# EAGLE design musicbusinesscard (EAGLE 9.4.2)
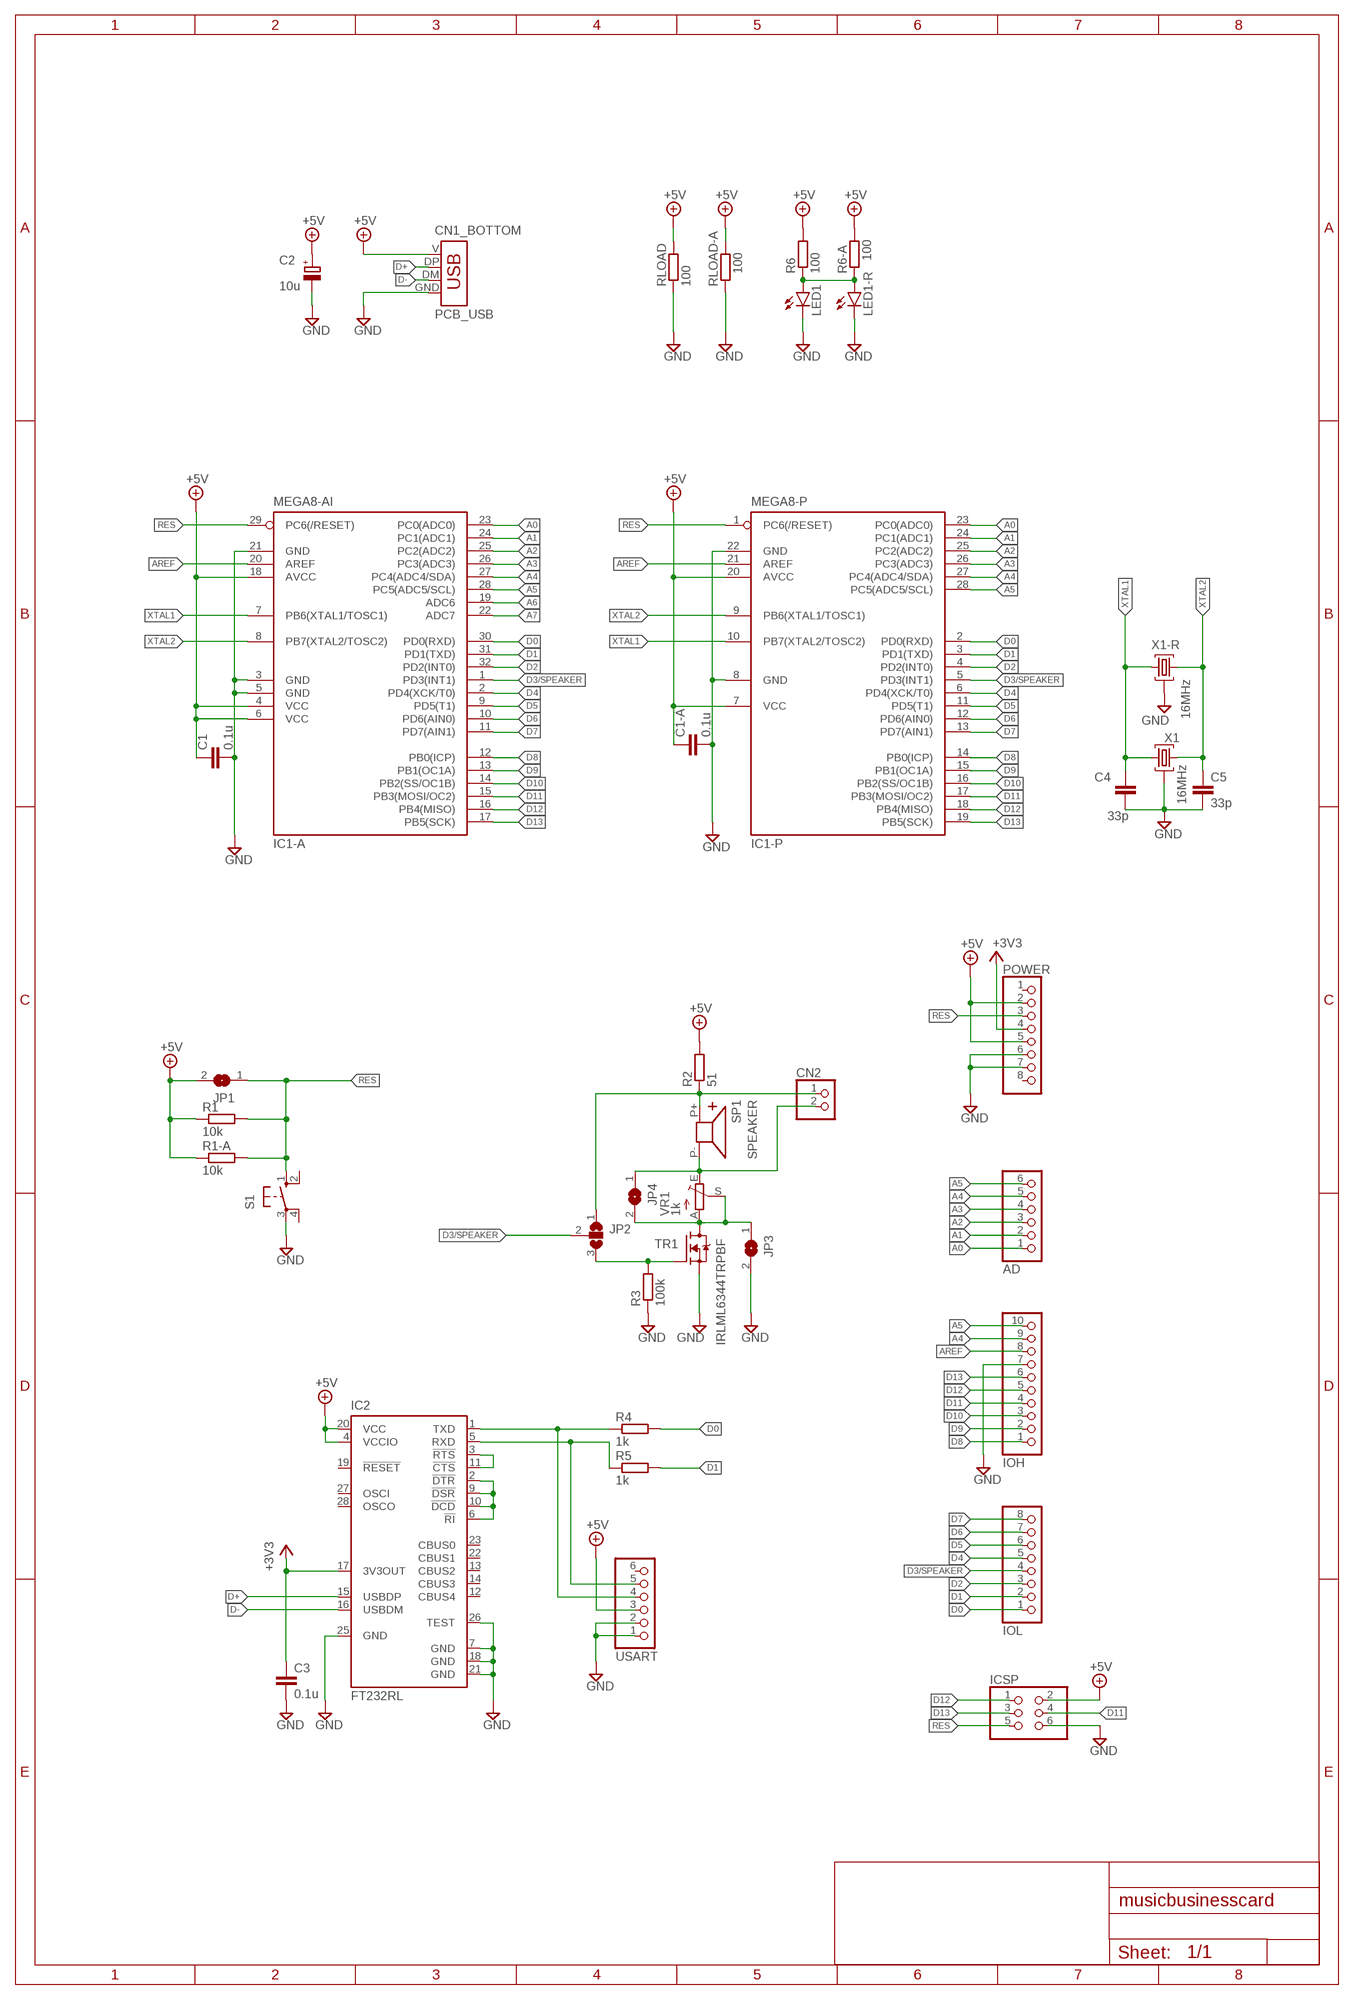
[diagram p0: schematic, sheet 1]

## Parts
AD  PINHD-1X6  [1X06]
C1  0.1u  C-EUC3216  [C3216]
C1-A  0.1u  C-EU050-024X044  [C050-024X044]
C2  10u  CPOL-EUTT2D5  [TT2D5]
C3  0.1u  C-EUC3216  [C3216]
C4  33p  C-EU050-024X044  [C050-024X044]
C5  33p  C-EU050-024X044  [C050-024X044]
CN1_BOTTOM  PCB_USB  [PCB_USB]
CN2  PINHD-1X2  [1X02]
IC1-A  MEGA8-AI  [TQFP32-08]
IC1-P  MEGA8-P  [DIL28-3]
IC2  FT232RL  [SSOP28]
ICSP  PINHD-2X3  [2X03]
IOH  PINHD-1X10  [1X10]
IOL  PINHD-1X8  [1X08]
JP1  SJ  [SJ]
JP2  SJ2W  [SJ_2]
JP3  SJ  [SJ]
JP4  SJ  [SJ]
LED1  LEDCHIPLED_1206  [CHIPLED_1206]
LED1-R  LED3MM  [LED3MM]
POWER  PINHD-1X8  [1X08]
R1  10k  R-EU_R3216  [R3216]
R1-A  10k  R-EU_0207/10  [0207/10]
R2  51  R-EU_R3216  [R3216]
R3  100k  R-EU_R3216  [R3216]
R4  1k  R-EU_R3216  [R3216]
R5  1k  R-EU_R3216  [R3216]
R6  100  R-EU_R3216  [R3216]
R6-A  100  R-EU_0207/10  [0207/10]
RLOAD  100  R-EU_R3216  [R3216]
RLOAD-A  100  R-EU_0207/10  [0207/10]
S1  10-XX  [B3F-10XX]
SP1  SPEAKER  [SPEAKER]
TR1  IRLML6344TRPBF  [SOT23]
USART  PINHD-1X6  [1X06]
VR1  1k  TRIM_EU-B25P  [B25P]
X1  16MHz  XTAL_MURATA  [XTAL_MURATA]
X1-R  16MHz  14M20BHC49T  [HC49U]

## Nets
+3V3: C3.1 IC2.17(3V3OUT) POWER.4
+5V [power]: C1-A.1 C1.1 C2.+ CN1_BOTTOM.V IC1-A.4(VCC) IC1-A.6(VCC) IC1-A.18(AVCC) IC1-P.7(VCC) IC1-P.20(AVCC) IC2.4(VCCIO) IC2.20(VCC) ICSP.2 JP1.2 POWER.2 POWER.5 R1-A.1 R1.1 R2.2 R6-A.2 R6.2 RLOAD-A.2 RLOAD.2 USART.3
A0: AD.1 IC1-A.23(PC0(ADC0)) IC1-P.23(PC0(ADC0))
A1: AD.2 IC1-A.24(PC1(ADC1)) IC1-P.24(PC1(ADC1))
A2: AD.3 IC1-A.25(PC2(ADC2)) IC1-P.25(PC2(ADC2))
A3: AD.4 IC1-A.26(PC3(ADC3)) IC1-P.26(PC3(ADC3))
A4: AD.5 IC1-A.27(PC4(ADC4/SDA)) IC1-P.27(PC4(ADC4/SDA)) IOH.9
A5: AD.6 IC1-A.28(PC5(ADC5/SCL)) IC1-P.28(PC5(ADC5/SCL)) IOH.10
A6: IC1-A.19(ADC6)
A7: IC1-A.22(ADC7)
AREF: IC1-A.20(AREF) IC1-P.21(AREF) IOH.8
D0: IC1-A.30(PD0(RXD)) IC1-P.2(PD0(RXD)) IOL.1 R4.2
D1: IC1-A.31(PD1(TXD)) IC1-P.3(PD1(TXD)) IOL.2 R5.2
D2: IC1-A.32(PD2(INT0)) IC1-P.4(PD2(INT0)) IOL.3
D3/SPEAKER: IC1-A.1(PD3(INT1)) IC1-P.5(PD3(INT1)) IOL.4 JP2.2
D4: IC1-A.2(PD4(XCK/T0)) IC1-P.6(PD4(XCK/T0)) IOL.5
D5: IC1-A.9(PD5(T1)) IC1-P.11(PD5(T1)) IOL.6
D6: IC1-A.10(PD6(AIN0)) IC1-P.12(PD6(AIN0)) IOL.7
D7: IC1-A.11(PD7(AIN1)) IC1-P.13(PD7(AIN1)) IOL.8
D8: IC1-A.12(PB0(ICP)) IC1-P.14(PB0(ICP)) IOH.1
D9: IC1-A.13(PB1(OC1A)) IC1-P.15(PB1(OC1A)) IOH.2
D10: IC1-A.14(PB2(SS/OC1B)) IC1-P.16(PB2(SS/OC1B)) IOH.3
D11: IC1-A.15(PB3(MOSI/OC2)) IC1-P.17(PB3(MOSI/OC2)) ICSP.4 IOH.4
D12: IC1-A.16(PB4(MISO)) IC1-P.18(PB4(MISO)) ICSP.1 IOH.5
D13: IC1-A.17(PB5(SCK)) IC1-P.19(PB5(SCK)) ICSP.3 IOH.6
D+: CN1_BOTTOM.DP IC2.15(USBDP)
D-: CN1_BOTTOM.DM IC2.16(USBDM)
GND: C1-A.2 C1.2 C2.- C3.2 C4.2 C5.2 CN1_BOTTOM.GND IC1-A.3(GND) IC1-A.5(GND) IC1-A.21(GND) IC1-P.8(GND) IC1-P.22(GND) IC2.7(GND) IC2.18(GND) IC2.21(GND) IC2.25(GND) IC2.26(TEST) ICSP.6 IOH.7 JP3.2 LED1-R.K(C) LED1.C POWER.6 POWER.7 R3.1 RLOAD-A.1 RLOAD.1 S1.3(P) TR1.2(S) USART.1 USART.2 X1-R.2 X1.2
N$1: JP2.3 R3.2 TR1.1(G)
N$2: CN2.2 JP4.1 SP1.P- VR1.E
N$3: CN2.1 JP2.1 R2.1 SP1.P+
N$4: JP3.1 JP4.2 TR1.3(D) VR1.A VR1.S
N$5: IC2.2(!DTR) IC2.6(!RI) IC2.9(!DSR) IC2.10(!DCD)
N$6: IC2.3(!RTS) IC2.11(!CTS)
N$7: IC2.1(TXD) R4.1 USART.4
N$8: IC2.5(RXD) R5.1 USART.5
N$9: LED1-R.A LED1.A R6-A.1 R6.1
RES: IC1-A.29(PC6(/RESET)) IC1-P.1(PC6(/RESET)) ICSP.5 JP1.1 POWER.3 R1-A.2 R1.2 S1.1(S)
XTAL1: C4.1 IC1-A.7(PB6(XTAL1/TOSC1)) IC1-P.10(PB7(XTAL2/TOSC2)) X1-R.1 X1.1
XTAL2: C5.1 IC1-A.8(PB7(XTAL2/TOSC2)) IC1-P.9(PB6(XTAL1/TOSC1)) X1-R.3 X1.3
Unconnected: IC2.12(CBUS4) IC2.13(CBUS2) IC2.14(CBUS3) IC2.19(!RESET) IC2.22(CBUS1) IC2.23(CBUS0) IC2.27(OSCI) IC2.28(OSCO) POWER.1 POWER.8 S1.2(S1) S1.4(P1) USART.6

## Library data of the parts
AD USART = pinhead-k:PINHD-1X6: PIN HEADER
C1 C1-A C3-C5 = rcl:C-EU: CAPACITOR, European symbol; SPICEPREFIX: C
C2 = rcl:CPOL-EU: POLARIZED CAPACITOR, European symbol; SPICEPREFIX: C
CN1_BOTTOM = pcb_usb:PCB_USB
CN2 = pinhead-k:PINHD-1X2: PIN HEADER
IC1-A = atmel:MEGA8: MICROCONTROLLER 8 Kbytes FLASH, 1 kbytes SRAM, 512 bytes EEPROM, USART, 6-channel 10 bit ADC, 2-channel 8 bit ADC Pin compatible with Atmega48, ATMega88, ATMega168 Source: avr.lbr; MPN: ATMEGA8-16AU; OC_FARNELL: 9171371; OC_NEWARK: 73M8863
IC1-P = atmel:MEGA8-P: MICROCONTROLLER 8 Kbytes FLASH, 1 kbytes SRAM, 512 bytes EEPROM, USART, 4-channel 10 bit ADC, 2-channel 8 bit ADC Pin compatible with Atmega48, ATMega88, ATMega168 Source: avr.lbr; OC_FARNELL: unknown; OC_NEWARK: unknown
IC2 = ftdichip:FT232R: Source: http://www.ftdichip.com/Documents/DataSheets/DS_FT232R_v104.pdf; MPN: FT232RL; OC_FARNELL: 1146032; OC_NEWARK: 91K9918
ICSP = pinhead:PINHD-2X3: PIN HEADER
IOH = pinhead-k:PINHD-1X10: PIN HEADER
IOL POWER = pinhead-k:PINHD-1X8: PIN HEADER
JP1 JP3 JP4 = jumper:SJ: SMD solder JUMPER
JP2 = jumper:SJ2W: SMD solder JUMPER
LED1 LED1-R = led:LED: LED OSRAM: - CHIPLED LG R971, LG N971, LY N971, LG Q971, LY Q971, LO R971, LY R971 LH N974, LH R974 LS Q976, LO Q976, LY Q976 LO Q996 - Hyper CHIPLED LW Q18S LB Q993, LB Q99A, LB R99A - SideLED LS A670, LO A670, LY A670, LG A670, LP A670 LB A673, LV A673, LT A673, LW A673 LH A674 LY A675 LS A676, LA A676, LO A676, LY A676, LW A676 LS A679, LY A679, LG A679 - Hyper Micro SIDELED® LS Y876, LA Y876, LO Y876, LY Y876 LT Y87S - SmartLED LW L88C, LW L88S LB L89C, LB L89S, LG L890 LS L89K, LO L89K, LY L89K LS L896, LA L896, LO L896, LY L896 - TOPLED LS T670, LO T670, LY T670, LG T670, LP T670 LSG T670, LSP T670, LSY T670, LOP T670, LYG T670 LG T671, LOG T671, LSG T671 LB T673, LV T673, LT T673, LW T673 LH T674 LS T676, LA T676, LO T676, LY T676, LB T676, LH T676, LSB T676, LW T676 LB T67C, LV T67C, LT T67C, LS T67K, LO T67K, LY T67K, LW E67C LS E67B, LA E67B, LO E67B, LY E67B, LB E67C, LV E67C, LT E67C LW T67C LS T679, LY T679, LG T679 LS T770, LO T770, LY T770, LG T770, LP T770 LB T773, LV T773, LT T773, LW T773 LH T774 LS E675, LA E675, LY E675, LS T675 LS T776, LA T776, LO T776, LY T776, LB T776 LHGB T686 LT T68C, LB T68C - Hyper Mini TOPLED® LB M676 - Mini TOPLED Santana® LG M470 LS M47K, LO M47K, LY M47K Source: http://www.osram.convergy.de LUXEON: - LUMILED® LXK2-PW12-R00, LXK2-PW12-S00, LXK2-PW14-U00, LXK2-PW14-V00 LXK2-PM12-R00, LXK2-PM12-S00, LXK2-PM14-U00 LXK2-PE12-Q00, LXK2-PE12-R00, LXK2-PE12-S00, LXK2-PE14-T00, LXK2-PE14-U00 LXK2-PB12-K00, LXK2-PB12-L00, LXK2-PB12-M00, LXK2-PB14-N00, LXK2-PB14-P00, LXK2-PB14-Q00 LXK2-PR12-L00, LXK2-PR12-M00, LXK2-PR14-Q00, LXK2-PR14-R00 LXK2-PD12-Q00, LXK2-PD12-R00, LXK2-PD12-S00 LXK2-PH12-R00, LXK2-PH12-S00 LXK2-PL12-P00, LXK2-PL12-Q00, LXK2-PL12-R00 Source: www.luxeon.com KINGBRIGHT: KA-3528ASYC Source: www.kingbright.com
R1 R1-A R2-R6 R6-A RLOAD RLOAD-A = rcl:R-EU_: RESISTOR, European symbol; SPICEPREFIX: R
S1 = switch-omron:10-XX: OMRON SWITCH; MPN: B3F-1000; OC_FARNELL: 176432; OC_NEWARK: 36M3542
SP1 = CAD_001:SPEAKER
TR1 = CAD_001:IRLML6344TRPBF
VR1 = pot:TRIM_EU-: POTENTIOMETER
X1 = murata-ceralok:XTAL_MURATA
X1-R = crystal:14M20BHC49T: Monolithic Crystal Filters Source: www.vanlong.com; OC_FARNELL: unknown; OC_NEWARK: unknown

## Net classes
0 default: width 0.2 mm, drill 0.4 mm, clearance 0.203 mm
1 power: width 0.4 mm, drill 0.4 mm, clearance 0.203 mm

## Board
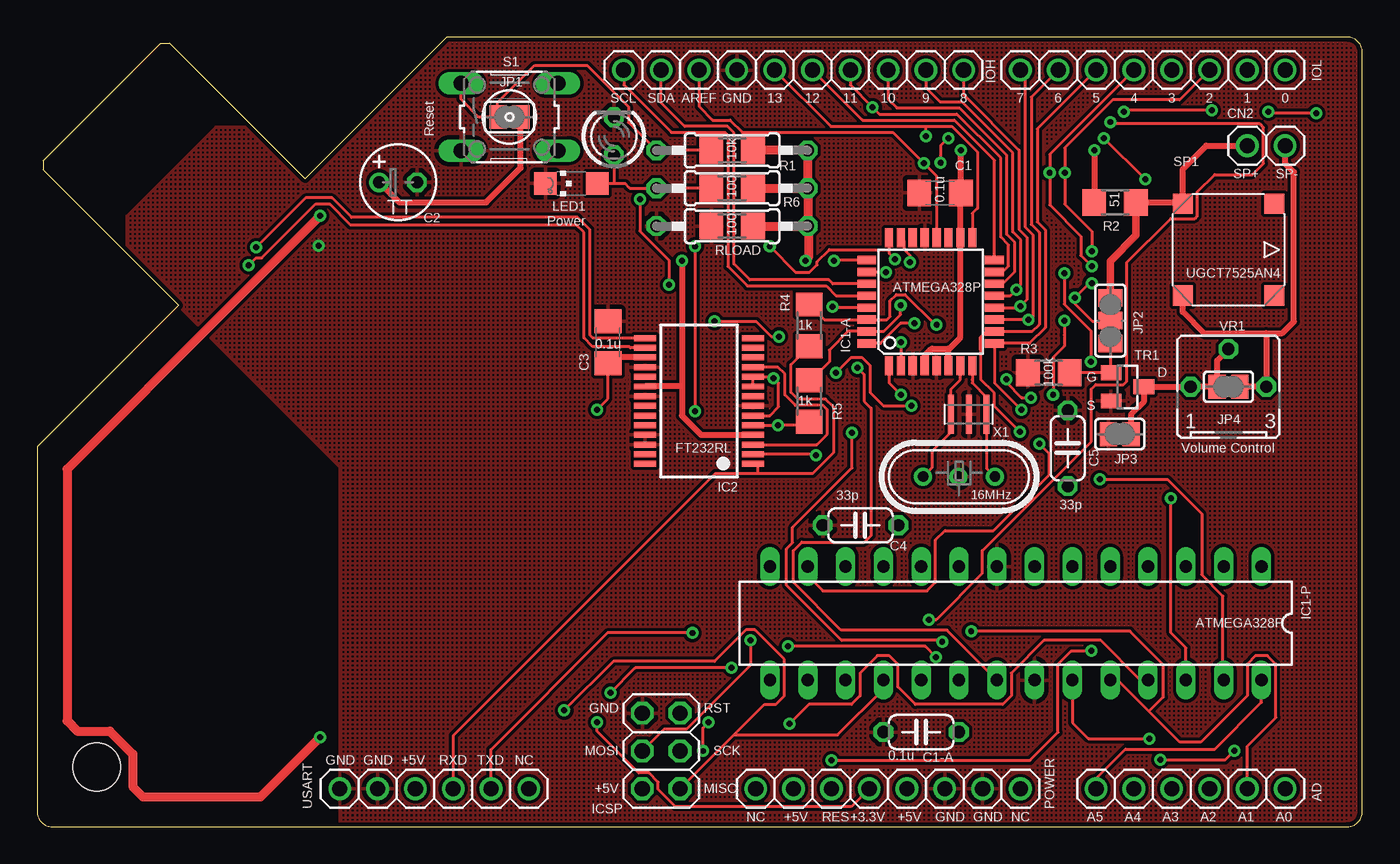
[diagram p1: board, top side]
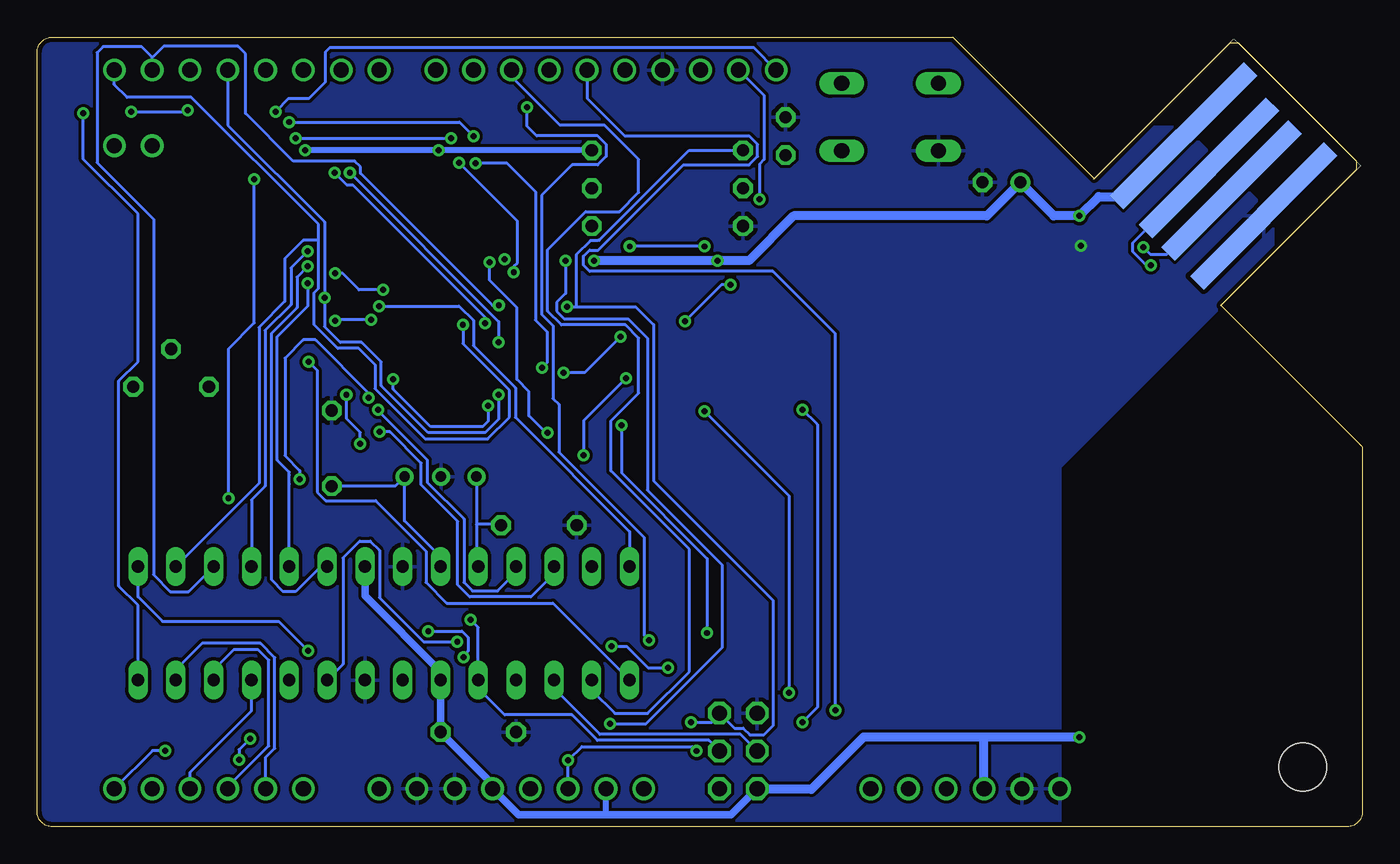
[diagram p2: board, bottom side, seen from below]

Size 89 x 53 mm. Coordinates in mm from the lower left corner, seen from the top.
Outline: 1,0 88,0 arc90 89,1 89,52 arc90 88,53 27.5,53 18,43.5 8.9,52.6 8.3,52.6 0.4,44.7 0.4,44.1 9.5,35 0,25.5 0,1 arc90 1,0
Copper layers (1*16): Top 0.035mm / dielectric 1.5mm / Bottom 0.035mm
Design rules "wsc *": minimum track width 6mil, minimum drill 0.35mm, track to track 0.21mm, track to pad 0.21mm, pad to pad 0.21mm, via to via 0.21mm, smd to smd 0.21mm, copper to edge 0.3mm, drill to drill 6mil, minimum pad ring 10mil, minimum via ring 8mil, stop-mask expansion 4mil, vias tented up to drill 0mil, thermal gap 0.3mm
Holes 3.2 mm at 4,4

### Footprints (pad centres in the part's own frame; a part is rotated, then mirrored left to right if it is on the bottom)
1X06 = drill 1.016: 1 -6.35,0; 2 -3.81,0; 3 -1.27,0; 4 1.27,0; 5 3.81,0; 6 6.35,0
C3216 = smd 1.6 x 1.8: 1 -1.4,0; 2 1.4,0
C050-024X044 = drill 0.813 octagon: 1 -2.54,0; 2 2.54,0
TT2D5 = drill 0.813: + -1.27,0 | drill 0.813 octagon: - 1.27,0
PCB_USB = smd 1.27 x 12.065 rotated 45: DM -0.732,-0.796; DP 0.794,0.731 | smd 1.27 x 12.7 rotated 45: GND 2.501,2.886; V -2.888,-2.502
1X02 = drill 1.016: 1 -1.27,0; 2 1.27,0
TQFP32-08 = smd 1.27 x 0.559: 1 -4.293,2.8; 2 -4.293,2; 3 -4.293,1.2; 4 -4.293,0.4; 5 -4.293,-0.4; 6 -4.293,-1.2; 7 -4.293,-2; 8 -4.293,-2.8; 17 4.293,-2.8; 18 4.293,-2; 19 4.293,-1.2; 20 4.293,-0.4; 21 4.293,0.4; 22 4.293,1.2; 23 4.293,2; 24 4.293,2.8 | smd 0.559 x 1.27: 9 -2.8,-4.293; 10 -2,-4.293; 11 -1.2,-4.293; 12 -0.4,-4.293; 13 0.4,-4.293; 14 1.2,-4.293; 15 2,-4.293; 16 2.8,-4.293; 25 2.8,4.293; 26 2,4.293; 27 1.2,4.293; 28 0.4,4.293; 29 -0.4,4.293; 30 -1.2,4.293; 31 -2,4.293; 32 -2.8,4.293
DIL28-3 = drill 0.813 long: 1 -16.51,-3.81; 2 -13.97,-3.81; 3 -11.43,-3.81; 4 -8.89,-3.81; 5 -6.35,-3.81; 6 -3.81,-3.81; 7 -1.27,-3.81; 8 1.27,-3.81; 9 3.81,-3.81; 10 6.35,-3.81; 11 8.89,-3.81; 12 11.43,-3.81; 13 13.97,-3.81; 14 16.51,-3.81; 15 16.51,3.81; 16 13.97,3.81; 17 11.43,3.81; 18 8.89,3.81; 19 6.35,3.81; 20 3.81,3.81; 21 1.27,3.81; 22 -1.27,3.81; 23 -3.81,3.81; 24 -6.35,3.81; 25 -8.89,3.81; 26 -11.43,3.81; 27 -13.97,3.81; 28 -16.51,3.81
SSOP28 = smd 0.4 x 1.5: 1 -4.225,-3.625; 2 -3.575,-3.625; 3 -2.925,-3.625; 4 -2.275,-3.625; 5 -1.625,-3.625; 6 -0.975,-3.625; 7 -0.325,-3.625; 8 0.325,-3.625; 9 0.975,-3.625; 10 1.625,-3.625; 11 2.275,-3.625; 12 2.925,-3.625; 13 3.575,-3.625; 14 4.225,-3.625; 15 4.225,3.625; 16 3.575,3.625; 17 2.925,3.625; 18 2.275,3.625; 19 1.625,3.625; 20 0.975,3.625; 21 0.325,3.625; 22 -0.325,3.625; 23 -0.975,3.625; 24 -1.625,3.625; 25 -2.275,3.625; 26 -2.925,3.625; 27 -3.575,3.625; 28 -4.225,3.625
2X03 = drill 1.016 octagon: 1 -2.54,-1.27; 2 -2.54,1.27; 3 0,-1.27; 4 0,1.27; 5 2.54,-1.27; 6 2.54,1.27
1X10 = drill 1.016: 1 -11.43,0; 2 -8.89,0; 3 -6.35,0; 4 -3.81,0; 5 -1.27,0; 6 1.27,0; 7 3.81,0; 8 6.35,0; 9 8.89,0; 10 11.43,0
1X08 = drill 1.016: 1 -8.89,0; 2 -6.35,0; 3 -3.81,0; 4 -1.27,0; 5 1.27,0; 6 3.81,0; 7 6.35,0; 8 8.89,0
SJ = smd 1.168 x 1.6: 1 -0.762,0; 2 0.762,0
SJ_2 = smd 1.168 x 1.6: 1 -1.524,0; 2 0,0; 3 1.524,0
CHIPLED_1206 = smd 1.5 x 1.5: A 0,-1.75; C 0,1.75
LED3MM = drill 0.813 octagon: A -1.27,0; K 1.27,0
R3216 = smd 1.6 x 1.8: 1 -1.4,0; 2 1.4,0
0207/10 = drill 0.813 octagon: 1 -5.08,0; 2 5.08,0
B3F-10XX = drill 1.016 long: 1 -3.251,2.261; 2 3.251,2.261; 3 -3.251,-2.261; 4 3.251,-2.261
SPEAKER = smd 1.35 x 1.35: D1 3.075,3.075; D2 3.075,-3.075; P+ -3.075,3.075; P- -3.075,-3.075
SOT23 = smd 1 x 1.4: 1 -0.95,-1.1; 2 0.95,-1.1; 3 0,1.1
B25P = drill 0.813 octagon: A -2.54,0; E 2.54,0; S 0,2.54
XTAL_MURATA = smd 0.4 x 2.6: 1 1.183,-0.066; 2 -0.017,-0.066; 3 -1.217,-0.066
HC49U = drill 0.7 pad 1.2: 1 -2.413,0; 2 -0.027,0; 3 2.413,0

### Placement (x,y rotation side)
AD  77.47,2.54 180 top
C1  60.64,42.55 180 top
C1-A  59.37,6.35 180 top
C2  24.24,43.25 0 top
C3  38.34,32.52 90 top
C4  55.3,20.23 180 top
C5  69.22,25.4 90 top
CN1_BOTTOM  9.5,43.5 270 bottom
CN2  82.55,45.72 0 top
IC1-A  60.01,35.24 90 top
IC1-P  65.72,13.65 180 top
IC2  44.45,28.57 90 top
ICSP  41.91,5.08 90 top
IOH  50.8,50.8 180 top
IOL  74.93,50.8 180 top
JP1  31.71,47.64 0 top
JP2  72.07,33.97 270 top
JP3  72.71,26.35 180 top
JP4  80.01,29.53 180 top
LED1  35.88,43.18 90 top
LED1-R  38.73,46.35 90 top
POWER  57.15,2.54 0 top
R1  46.67,45.4 180 top
R1-A  46.67,45.4 180 top
R2  72.39,41.91 180 top
R3  67.94,30.48 0 top
R4  51.85,33.66 90 top
R5  51.85,28.57 90 top
R6  46.67,42.86 0 top
R6-A  46.67,42.86 0 top
RLOAD  46.67,40.32 0 top
RLOAD-A  46.67,40.32 0 top
S1  31.71,47.64 0 top
SP1  80.01,38.73 0 top
TR1  73.22,29.53 270 top
USART  26.67,2.54 0 top
VR1  80.01,29.53 0 top
X1  62.55,27.62 180 top
X1-R  61.91,23.5 0 top

### Tracks (layer width: path | path; a pad name or v marks a point on that pad's centre or on a via)
+3V3  (via drill 0.4)
  Top 0.2: C3.1 38.34,28.73 v37.6,28 | v37.6,7 37.6,6.41 40.4,3.61 41.08,3.61 41.71,2.98 41.71,2.49 42.86,1.34 54.68,1.34 POWER.4
  Top 0.4: IC2.17 38.72,31.5 C3.1
  Bottom 0.2: v37.6,7 36.6,8 36.6,27 v37.6,28
+5V  (via drill 0.4)
  Top 0.4: v62.04,45.4 C1.1 62.01,42.51 IC1-A.18 62.01,32.83 61.28,32.1 61.2,32.1 | v43.3,38 43.3,29.55 | 43.3,29.55 IC2.20 | 43.3,29.55 43.3,27.6 44.6,26.3 IC2.4 | v71,45.4 R2.2 | IC1-A.4 59.61,31.64 59.96,32 59.99,32 60.1,32.1 61.2,32.1 | IC1-A.6 61.21,32.09 61.2,32.1 | C2.+ 24.31,41.91 30.16,41.91 32.48,44.22 32.48,47.4
  Top 0.5: 32.48,47.4 JP1.2
  Top 0.6: v19,41 12.8,34.8 2,24 2,7.1 2.68,6.42 4.87,6.42 6.42,4.87 6.42,2.68 7.1,2 15,2 v19,6 | v51.6,38 51.8,38.2 51.8,40.27 RLOAD-A.2 | R6-A.2 RLOAD-A.2 | R6-A.2 R1-A.1 R1.1 | R6.2 R6-A.2 | RLOAD.2 RLOAD-A.2
  Bottom 0.4: R1-A.1 v62.04,45.4 v71,45.4 | 50.8,0.79 POWER.2
  Bottom 0.5: ICSP.2 42.39,0.79 50.8,0.79 56.67,0.79 POWER.5 58.42,2.86 C1-A.1 IC1-P.20 61.91,10.41 66.99,15.49 IC1-P.7
  Bottom 0.6: CN1_BOTTOM.V 16.09,42.3 17.7,42.3 v19,41 20.71,41 C2.+ 25.22,41 38.2,41 41.2,38 v43.3,38 v51.6,38 | v19,6 25.5,6 | 25.5,6 33.5,6 37,2.5 40.6,2.5 ICSP.2 | USART.3 25.4,5.9 25.5,6
A0  (via drill 0.4)
  Top 0.2: IC1-P.23 69.53,6.99 70.6,5.91 v74.7,5.91 | IC1-A.23 58.22,39.33 58.22,38.77 58.62,38.37 v58.62,37.9 | v54.73,26.45 54.73,24.09 50.74,20.09 50.74,19.07 50.33,18.66 50.33,16.2 54.02,12.51 60.68,12.51 v60.78,12.4 | v75.44,4.49 79.79,4.49 v80.4,5.1
  Bottom 0.2: v54.73,26.45 54.84,26.45 55.97,27.57 55.97,29.21 56.78,30.03 56.78,34.85 58.62,36.68 v58.62,37.9 | v60.78,12.4 63.04,12.4 66.01,15.38 66.01,18.55 66.62,19.17 67.34,19.17 68.47,18.04 68.47,10.9 IC1-P.23 | v74.7,5.91 75.44,5.17 v75.44,4.49 | v80.4,5.1 81.26,5.1 AD.1
A1  (via drill 0.4)
  Top 0.2: AD.2 81.28,5.4 83.2,7.32 83.2,10.9 82.63,11.47 81.83,11.47 81.26,10.9 81.26,8.78 78.15,5.67 76.75,5.67 74.68,7.75 | IC1-P.24 72.58,9.84 74.68,7.75 | IC1-A.24 57.21,38.74 | 57.21,38.74 57.21,38.49 v57.6,38.1 | 57.21,38.74 53.2,38.74 52.38,37.92 52.38,37.72 51.87,37.21 50.94,37.21 v49.2,38.95 | v46.64,10.66 40.16,10.66 v38.5,9 | v50.43,12.1 59.66,12.1 v60.37,11.38 | v62.73,13.12 73.39,13.12 75.64,10.87 75.64,8.71 74.68,7.75 | v44.18,38.95 v44.18,27.88
  Bottom 0.2: v44.18,38.95 v49.2,38.95 | v46.64,10.66 47.97,10.66 49.41,12.1 v50.43,12.1 | v60.37,11.38 60.37,11.47 60.06,11.78 60.06,12.71 60.48,13.12 v62.73,13.12 | v38.5,9 38.5,22.2 v44.18,27.88
A2  (via drill 0.4)
  Top 0.2: v50.52,6.91 51.82,8.21 54.69,8.21 55.26,8.78 55.26,10.31 56.43,11.47 57.23,11.47 57.8,10.9 57.8,9.38 58.97,8.21 64.85,8.21 65.42,8.78 65.42,10.31 67.63,12.51 71.44,12.51 74.11,9.84 IC1-P.25 | IC1-A.25 53.56,38.04 v53.51,38
  Bottom 0.2: AD.3 78.74,3.64 74.61,7.77 IC1-P.25 | v50.52,6.91 48.1,6.91 43.01,12.01 43.01,17.59 48.01,22.59 48.01,32.79 49.32,34.1 53.6,34.1 54.11,34.6 54.11,35.2 53.51,35.8 v53.51,38
A3  (via drill 0.4)
  Top 0.2: v60.68,44.59 60.68,45.72 v61.19,46.23 | v74.42,43.46 v71.65,46.23 | v76.16,22.04 76.16,13 77.15,12.01 IC1-P.26 | v56.99,37.21 55.75,37.21 IC1-A.26
  Bottom 0.2: v56.99,37.21 56.99,37.62 56.78,37.82 56.78,40.69 v60.68,44.59 | v71.65,46.23 v61.19,46.23 | v74.42,43.46 74.42,33.83 76.16,32.08 v76.16,22.04 | AD.4 76.2,2.68 73.45,5.43 73.45,11.17 74.17,11.89 75.8,11.89 77.15,10.54 IC1-P.26
A4  (via drill 0.4)
  Top 0.2: IC1-A.27 53.44,36.44 53.17,36.71 47.87,36.71 46.79,37.79 46.79,46.6 46.37,47.02 43.48,47.02 41.91,48.59 IOH.9 | v71.36,23.31 75.91,23.31 78.21,21.01 78.21,16.91 79.64,15.48 79.64,9.89 IC1-P.27 | v66.73,28.8 66.11,28.8 65.09,29.83 v65.09,30.03 | v49.81,32.9 49.3,32.9 48.28,33.93 v45.49,33.93 | v42.44,36.39 42.44,38.03 40.49,39.98 v40.49,42.13 | v53.64,30.48 54.68,31.51 55.4,31.51 55.94,30.97 55.94,29.15 56.83,28.26 v58.71,28.26
  Bottom 0.2: IC1-P.27 79.69,10.54 77.93,12.3 74,12.3 73.04,11.34 73.04,5.26 73.66,4.64 AD.5 | v71.36,23.31 71.36,23.91 72.36,24.91 72.36,31.46 71.13,32.69 70.31,32.69 66.73,29.11 v66.73,28.8 | v42.44,36.39 43.03,36.39 v45.49,33.93 | v40.49,42.13 40.49,44.48 40.18,44.79 40.18,49.1 41.82,50.74 41.85,50.74 IOH.9 | v49.81,32.9 52.24,30.48 v53.64,30.48 | v58.71,28.26 58.71,27.22 59.08,26.86 62.58,26.86 65.09,29.37 v65.09,30.03
A5  (via drill 0.4)
  Top 0.2: IOH.10 39.4,50.77 39.4,49.8 42.59,46.61 46.2,46.61 46.38,46.43 46.38,37.62 47.7,36.3 53,36.3 53.66,35.64 IC1-A.28 | AD.6 71.12,3.22 73.1,5.2 79.1,5.2 82.23,8.33 IC1-P.28 | v85.9,47.9 82.8,47.9 v82.7,48 | v78.9,48.1 73.1,48.1 v73,48
  Bottom 0.2: IC1-P.28 82.23,14.85 83.52,16.14 83.52,29.93 82.23,31.22 82.23,41.13 85.9,44.8 v85.9,47.9 | v82.7,48 79,48 v78.9,48.1 | IOH.10 40.89,52.32 69.34,52.32 69.65,52.01 69.65,49.99 70.75,48.9 72.11,48.9 v73,48
AREF  (via drill 0.4)
  Top 0.2: IOH.8 44.45,48.35 45.37,47.43 46.54,47.43 47.36,46.61 57.49,46.61 v59.55,44.55 60.41,43.69 IC1-A.20 | IC1-P.21 61.11,13.19 53.99,13.19 50.78,16.4 50.78,18.52 51.35,19.09 55.56,19.09 56,19.54 56,28.11 55.53,28.57 55.53,30.37 v55.1,30.8
  Bottom 0.2: v59.55,44.55 57.45,44.55 55.53,42.63 55.53,34 54.77,33.23 54.77,31.13 v55.1,30.8
D0  (via drill 0.4)
  Top 0.2: R4.2 52.87,34.04 IC1-A.30 57.08,34.04 57.28,34.24 57.28,35.3 57.7,35.72 58.29,35.72 60.32,33.69 v60.41,33.69
  Bottom 0.2: v60.41,33.69 60.41,32.42 57.29,29.3 57.29,27.49 58.74,26.04 62.94,26.04 66.31,29.4 66.31,31.02 67.4,32.11 68.82,32.11 70.41,33.7 70.41,35.84 70.11,36.14 70.11,39.36 | IOL.1 83.82,49.82 82.97,48.97 78.65,48.97 70.11,40.43 70.11,39.36 | 70.11,39.36 71.14,39.36 72.36,38.13 72.36,35.26 74.11,33.52 74.11,23.05 IC1-P.2
D1  (via drill 0.4)
  Top 0.2: R5.2 51.98,29.98 53.2,31.2 53.2,32 54.44,33.24 IC1-A.31 56.86,33.24 58,34.38 v58,35
  Bottom 0.2: v58,35 58.42,35 67.29,43.87 67.29,44.3 67.68,44.69 71.81,44.69 75,47.88 75,51.88 75.5,52.38 80.52,52.38 81.28,51.62 IOL.2 81.28,51.66 81.99,52.37 84.57,52.37 84.97,51.97 84.97,44.59 81.18,40.8 81.18,16.91 80.05,15.79 78.83,15.79 IC1-P.3
D2  (via drill 0.4)
  Top 0.2: IOL.3 76.74,48.8 72.24,48.8 69.02,45.58 v69.02,43.9 69.02,41.79 70.83,39.98 v70.83,38.64 | v58.9,33.8 58,33.8 56.64,32.44 IC1-A.32
  Bottom 0.2: v58.9,33.8 58.9,34.19 67.81,43.09 68.21,43.09 v69.02,43.9 | v70.83,38.64 71.95,37.52 71.95,35.05 73.7,33.31 73.7,22.86 74.61,21.94 IC1-P.4
D3/SPEAKER  (via drill 0.4)
  Top 0.2: IC1-A.1 57.21,29.79 v58,29 | JP2.2 72,33.9 70.9,33.9 69.7,35.1 v69.7,35.52 70.67,36.49 v70.83,36.49
  Bottom 0.2: IOL.4 76.2,47.1 69.7,40.6 v69.7,35.52 69.7,33.57 68.65,32.52 67.22,32.52 65.9,31.2 65.9,29.6 62.74,26.45 58.91,26.45 58,27.35 v58,29 | v70.83,36.49 70.83,34.95 72.88,32.9 72.88,24.6 72.07,23.8 72.07,23.6 72.07,23.01 IC1-P.5
D4  (via drill 0.4)
  Top 0.2: IOL.5 68,45.14 v68,43.9 68,41.74 70.1,39.65 70.1,38.35 v70.83,37.62 | v58,32.52 IC1-A.2
  Bottom 0.2: v68,43.9 58,33.9 v58,32.52 | v70.83,37.62 71.55,36.9 71.55,34.85 73.29,33.11 73.29,16.61 72.47,15.79 71.65,15.79 69.97,17.46 IC1-P.6
D5  (via drill 0.4)
  Top 0.2: IOL.6 67.17,46.85 67.17,40.61 67.7,40.07 67.7,33.51 66.64,32.44 IC1-A.9 64.3,29.8 v66.1,28
  Bottom 0.2: v66.1,28 66.1,27.93 62.8,24.63 62.8,23.12 60.34,20.66 60.34,16.4 59.77,15.83 58.07,15.83 56.83,17.07 IC1-P.11
D6  (via drill 0.4)
  Top 0.2: IOL.7 66.76,48.98 66.76,40.44 67.3,39.9 67.3,33.7 66.84,33.24 IC1-A.10 64.26,33.2 63.7,33.2 63.35,32.85 63.35,32.03 63.4,31.99 63.4,29.99 64.27,29.12 64.27,28.23 65.65,26.85 v66,26.5
  Bottom 0.2: IC1-P.12 54.29,16.97 55.84,15.42 59.94,15.42 60.75,16.23 60.75,20.49 63.21,22.95 63.21,24.4 65.31,26.5 v66,26.5
D7  (via drill 0.4)
  Top 0.2: IOL.8 66.35,50.8 66.35,40.27 66.89,39.73 66.89,34.04 v66.58,34.04 IC1-A.11 | IC1-P.13 51.75,16.85 52.77,15.83 59.77,15.83 60.34,16.4 60.34,19.24 60.98,19.88 64.24,19.88 67.98,23.62 67.98,25.02 v67.3,25.7 | v68.23,29 68.23,31.51 68.98,32.26 68.98,33.02 68.99,33.02 v68.99,33.97
  Bottom 0.2: v67.3,25.7 67.3,26.46 68.23,27.4 v68.23,29 | v66.58,34.04 68.92,34.04 v68.99,33.97
D8  (via drill 0.4)
  Top 0.2: IOH.1 62.23,49.12 65.94,45.41 65.94,40.1 66.47,39.56 66.47,35.38 v66.05,34.95 65.94,34.84 IC1-A.12
  Bottom 0.2: v66.05,34.95 60.67,34.95 59.7,33.98 59.7,32.29 56.88,29.46 56.88,27.48 49.21,19.81 IC1-P.14
D9  (via drill 0.4)
  Top 0.2: IOH.2 59.69,49.61 60.64,48.66 62.11,48.66 65.53,45.24 65.53,39.93 66.06,39.4 66.06,36.35 v65.75,36.05 65.35,35.64 IC1-A.13 | v70.76,31.2 70.76,33.3 68.99,35.08 v68.99,37.15
  Bottom 0.2: v65.75,36.05 67.38,36.05 68.48,37.15 v68.99,37.15 | IC1-P.15 49.21,9.85 54.37,15.01 61.49,15.01 62.88,16.4 62.88,18.5 66.27,21.89 69.62,21.89 70.19,22.46 70.19,30.63 v70.76,31.2
D10
  Top 0.2: IOH.3 57.15,48.84 57.74,48.25 61.94,48.25 65.12,45.07 65.12,39.76 65.66,39.23 65.66,37.24 64.86,36.45 64.31,36.45 IC1-A.14
  Bottom 0.2: IC1-P.16 51.75,9.15 50.2,7.6 48,7.6 45.2,10.4 45.2,18.62 50.46,23.88 50.46,27.25 48.6,29.11 48.6,32.8 49.49,33.69 53.8,33.69 54.71,34.6 54.71,38.73 52.15,41.29 49.9,41.29 48.6,42.59 48.6,44.8 50.9,47.1 53.9,47.1 57.15,50.35 IOH.3
D11  (via drill 0.4)
  Top 0.2: IOH.4 54.61,49.8 v56.11,48.3 56.57,47.84 61.77,47.84 64.71,44.9 64.71,39.59 65.25,39.05 65.25,37.63 64.85,37.24 IC1-A.15 | ICSP.4 42.11,6.55 43.62,6.55 47.9,10.82 v47.9,12.5
  Bottom 0.2: ICSP.4 41.76,6.2 51.2,6.2 54.29,9.29 IC1-P.17 | v47.9,12.5 48.24,12.84 48.24,19.42 53.96,25.14 53.96,28.34 54.36,28.74 54.36,33.63 55.12,34.4 55.12,42.38 53.08,44.43 51.35,44.43 50.78,45 50.78,45.8 51.35,46.37 55.45,46.37 56.11,47.03 v56.11,48.3
D12  (via drill 0.4)
  Top 0.2: IC1-P.18 56.83,9.23 53.75,6.15 46.79,6.15 | ICSP.1 46.79,6.15 | IOH.5 55.44,47.43 61.6,47.43 64.3,44.73 IC1-A.16 | 46.79,6.15 48.85,8.21 49.61,8.21 50.18,8.78 50.18,11.23 48.2,13.21 47.6,13.21 45.49,11.1 38.7,11.1 v35.4,7.8
  Bottom 0.2: v35.4,7.8 35.4,33.1 39.59,37.29 51.9,37.29 52.31,37.7 52.31,38.3 51.9,38.71 51.32,38.71 45.6,44.43 41.19,44.43 40.62,45 40.62,45.8 41.19,46.37 49.55,46.37 52.07,48.9 IOH.5
D13  (via drill 0.4)
  Top 0.2: IC1-A.17 62.81,41.17 63.15,41.52 63.15,45.3 61.43,47.02 59.69,47.02 | IOH.6 53.31,47.02 59.69,47.02 | v59.9,13.9 60.38,13.9 63.48,17 63.48,18.52 70.8,25.84 70.8,29.37 71.1,29.67 72.95,29.67 73.18,29.9 73.18,37.88 76.12,40.83 77.74,40.83 77.92,41.01 77.92,42.62 79.08,43.78 81.62,43.78 82.35,44.51 82.35,46.93 82.1,47.18 72.2,47.18 v72.07,47.31 | v59.69,46.35 59.69,47.02
  Bottom 0.2: ICSP.3 43.89,5.79 51.37,5.79 53.08,7.5 57.6,7.5 59.37,9.27 IC1-P.19 59.37,13.37 v59.9,13.9 | v72.07,47.31 60.64,47.31 v59.69,46.35
D+  (via drill 0.4)
  Top 0.2: IC2.15 37.32,32.8 37.12,32.99 37.12,40.08 36.3,40.9 21.11,40.9 19.8,42.21 18.01,42.21 15.21,39.41 v14.7,38.9
  Bottom 0.2: CN1_BOTTOM.DP 8.87,42.71 13.18,38.4 14.2,38.4 v14.7,38.9
D-  (via drill 0.4)
  Top 0.2: IC2.16 39.84,32.15 39.76,32.23 37.31,32.23 36.72,32.82 36.72,39.91 36.23,40.39 21.04,40.39 19.63,41.8 18.7,41.8 15.09,38.19 14.7,38.19 v14.2,37.69
  Bottom 0.2: v14.2,37.69 14.49,37.69 15.41,38.6 15.41,39.2 10.38,44.23 CN1_BOTTOM.DM
GND  (via drill 0.4)
  Bottom 0.4: 7.79,39.98 7.79,39.97
  other vias: 18.9,39
  pour Bottom: 89,0 89,53 27.5,53 18,43.5 14.5,47 12,47 6,41 6,38.4 20.3,24.1 20.3,0
  pour Top (hatched): 89,0 89,53 27.5,53 18,43.5 14.5,47 12,47 6,41 6,38.4 20.3,24.1 20.3,0
N$1
  Top 0.2: JP2.3 72.07,30.53 TR1.1 R3.2
N$2
  Top 0.4: 82.55,33.14 VR1.E JP4.1 | SP1.P- 76.94,34.56 78.36,33.14 82.55,33.14 | 82.55,33.14 83.64,33.14 84.4,33.9 84.4,43.94 83.82,44.52 CN2.2
N$3
  Top 0.4: R2.1 76.83,41.91 SP1.P+ 76.94,44.13 78.52,45.72 CN2.1
  Top 0.5: JP2.1 72.07,37.97 73.8,39.7 R2.1
N$4
  Top 0.4: VR1.S 79.25,31.3 JP4.2 VR1.A TR1.3 74.33,28.52 73.47,27.67 JP3.1
N$5  (via drill 0.4)
  Top 0.2: IC2.2 52.3,25 v52.3,24.94 | IC2.6 49.2,27.6 49.8,28.2 49.8,29.8 49.46,30.14 | 49.46,30.14 49.4,30.2 IC2.10 IC2.9 | 49.46,30.14 v49.46,30.1
  Bottom 0.2: v49.46,30.1 52.3,27.26 v52.3,24.94
N$6
  Top 0.2: IC2.3 52.37,25.65 53.06,26.35 53.06,28 52.78,28.29 50.91,28.29 50.21,28.99 50.21,30.39 49.75,30.85 IC2.11
N$7
  Top 0.2: USART.4 27.94,6.12 45.52,23.7 48.42,23.7 | R4.1 50.62,31.02 50.62,29.16 51.09,28.7 52.95,28.7 53.47,28.17 53.47,25.1 52.07,23.7 48.42,23.7 | 48.42,23.7 48.42,24.23 48.6,24.4 48.12,24.4 IC2.1
N$8  (via drill 0.4)
  Top 0.2: IC2.5 v49.75,26.95 51.63,26.95 R5.1 | USART.5 30.48,5.17 38.3,13 v44,13
  Bottom 0.2: v49.75,26.95 49.75,23.75 44,18 v44,13
N$9
  Top 0.2: LED1.A 38.7,43.18 | 38.7,43.18 39.48,43.18 39.79,42.86 R6-A.1 R6.1 | LED1-R.A 38.73,43.22 38.7,43.18
RES  (via drill 0.4)
  Top 0.2: JP1.1 30.9,47.64 | 30.9,47.64 29.66,47.64 28.46,48.84 S1.1 | R1.2 R1-A.2 39.7,47.29 39.7,48.34 36.93,51.12 33.42,51.12 30.9,48.6 30.9,47.64 | IC1-A.29 53.46,34.84 v53.4,34.9 | v70.8,11.8 69.46,11.8 68.56,10.9 68.56,6.33 66.67,4.45 v53.34,4.45 | v44.71,5.08 44.71,6.61 v45.1,7
  Bottom 0.2: ICSP.5 43.13,7.57 | 43.13,7.57 42.17,6.61 41.59,6.61 41.13,6.15 40.2,6.15 39.57,6.78 39.57,8.06 39.57,8.07 39.57,15.18 47.6,23.21 47.6,33.7 48.8,34.9 52.8,34.9 | R1-A.2 45.21,45.4 51.25,39.35 51.35,39.35 51.85,39.35 52.8,38.4 52.8,34.9 | v53.4,34.9 52.8,34.9 | v70.8,11.8 72.78,13.78 80.58,13.78 82.23,15.43 IC1-P.1 | v44.71,5.08 44.71,5.09 44.99,5.37 52.41,5.37 v53.34,4.45 POWER.3 | v45.1,7 43.7,7 43.13,7.57
XTAL1
  Top 0.2: IC1-A.7 62.01,30.01 61.36,29.36 X1.1 61.36,26.46 60.11,25.21 60.11,24.11 X1-R.1
  Bottom 0.2: X1-R.1 59.5,20.3 | 59.5,20.3 59.5,17.59 IC1-P.10 | C4.1 57.91,20.3 59.5,20.3
XTAL2
  Top 0.2: IC1-A.8 62.81,30.01 62.8,30 62.8,29.8 63.76,28.84 X1.3 63.76,24.06 X1-R.3
  Bottom 0.2: IC1-P.9 61.91,18.11 64.33,20.53 X1-R.3 64.96,22.86 C5.1

### Text on the board
tPlace: SCL | SDA | 7 | 0.1u | 51 | UGCT7525AN4 | ATMEGA328P | 1k | 0.1u | 100k | G | D | 1k | S | FT232RL | 33p | 16MHz | 33p | ATMEGA328P | 0.1u
tNames: AREF | GND | 13 | 12 | 11 | 10 | 9 | 8 | 6 | 5 | 4 | 3 | 2 | 1 | 0 | Reset | 10k | SP+ | SP- | 100 | Power | 100 | Volume Control | GND | RST | MOSI | SCK | GND | GND | +5V | RXD | TXD | NC | +5V | MISO | NC | +5V | RES | +3.3V | +5V | GND | GND | NC | A5 | A4 | A3 | A2 | A1 | A0